# EAGLE design submod (EAGLE 4.13)
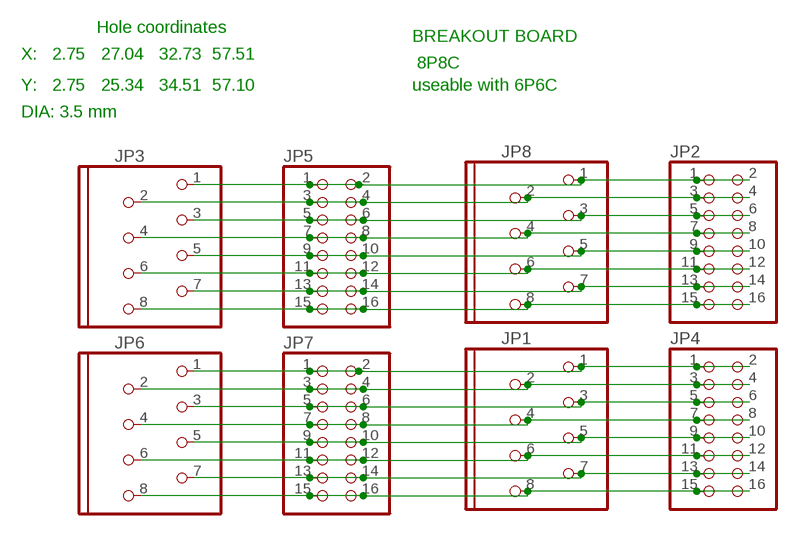
[diagram p0: schematic, sheet 1]

## Parts
JP1  MOD8P8C  [MOD8P8C]
JP2  PINHD-2X8  [2X08]
JP3  MOD8P8C  [MOD8P8C]
JP4  PINHD-2X8  [2X08]
JP5  PINHD-2X8  [2X08]
JP6  MOD8P8C  [MOD8P8C]
JP7  PINHD-2X8  [2X08]
JP8  MOD8P8C  [MOD8P8C]

## Nets
N$1: JP2.1 JP2.2 JP3.1 JP5.1 JP5.2 JP8.1
N$2: JP2.3 JP2.4 JP3.2 JP5.3 JP5.4 JP8.2
N$3: JP2.5 JP2.6 JP3.3 JP5.5 JP5.6 JP8.3
N$4: JP2.7 JP2.8 JP3.4 JP5.7 JP5.8 JP8.4
N$5: JP2.9 JP2.10 JP3.5 JP5.9 JP5.10 JP8.5
N$6: JP2.11 JP2.12 JP3.6 JP5.11 JP5.12 JP8.6
N$7: JP1.1 JP4.1 JP4.2 JP6.1 JP7.1 JP7.2
N$8: JP1.2 JP4.3 JP4.4 JP6.2 JP7.3 JP7.4
N$9: JP1.3 JP4.5 JP4.6 JP6.3 JP7.5 JP7.6
N$10: JP1.4 JP4.7 JP4.8 JP6.4 JP7.7 JP7.8
N$11: JP1.5 JP4.9 JP4.10 JP6.5 JP7.9 JP7.10
N$12: JP1.6 JP4.11 JP4.12 JP6.6 JP7.11 JP7.12
N$13: JP1.7 JP4.13 JP4.14 JP6.7 JP7.13 JP7.14
N$14: JP1.8 JP4.15 JP4.16 JP6.8 JP7.15 JP7.16
N$15: JP2.13 JP2.14 JP3.7 JP5.13 JP5.14 JP8.7
N$16: JP2.15 JP2.16 JP3.8 JP5.15 JP5.16 JP8.8

## Notes on the sheet
- Hole coordinates
- BREAKOUT BOARD
- X: | 2.75 | 27.04 | 32.73 | 57.51
- 8P8C
- Y: | 2.75 | 25.34 | 34.51 | 57.10 | useable with 6P6C
- DIA: 3.5 mm

## Library data of the parts
JP1 JP3 JP6 JP8 = DEH:MOD8P8C
JP2 JP4 JP5 JP7 = pinhead:PINHD-2X8: PIN HEADER

## Board
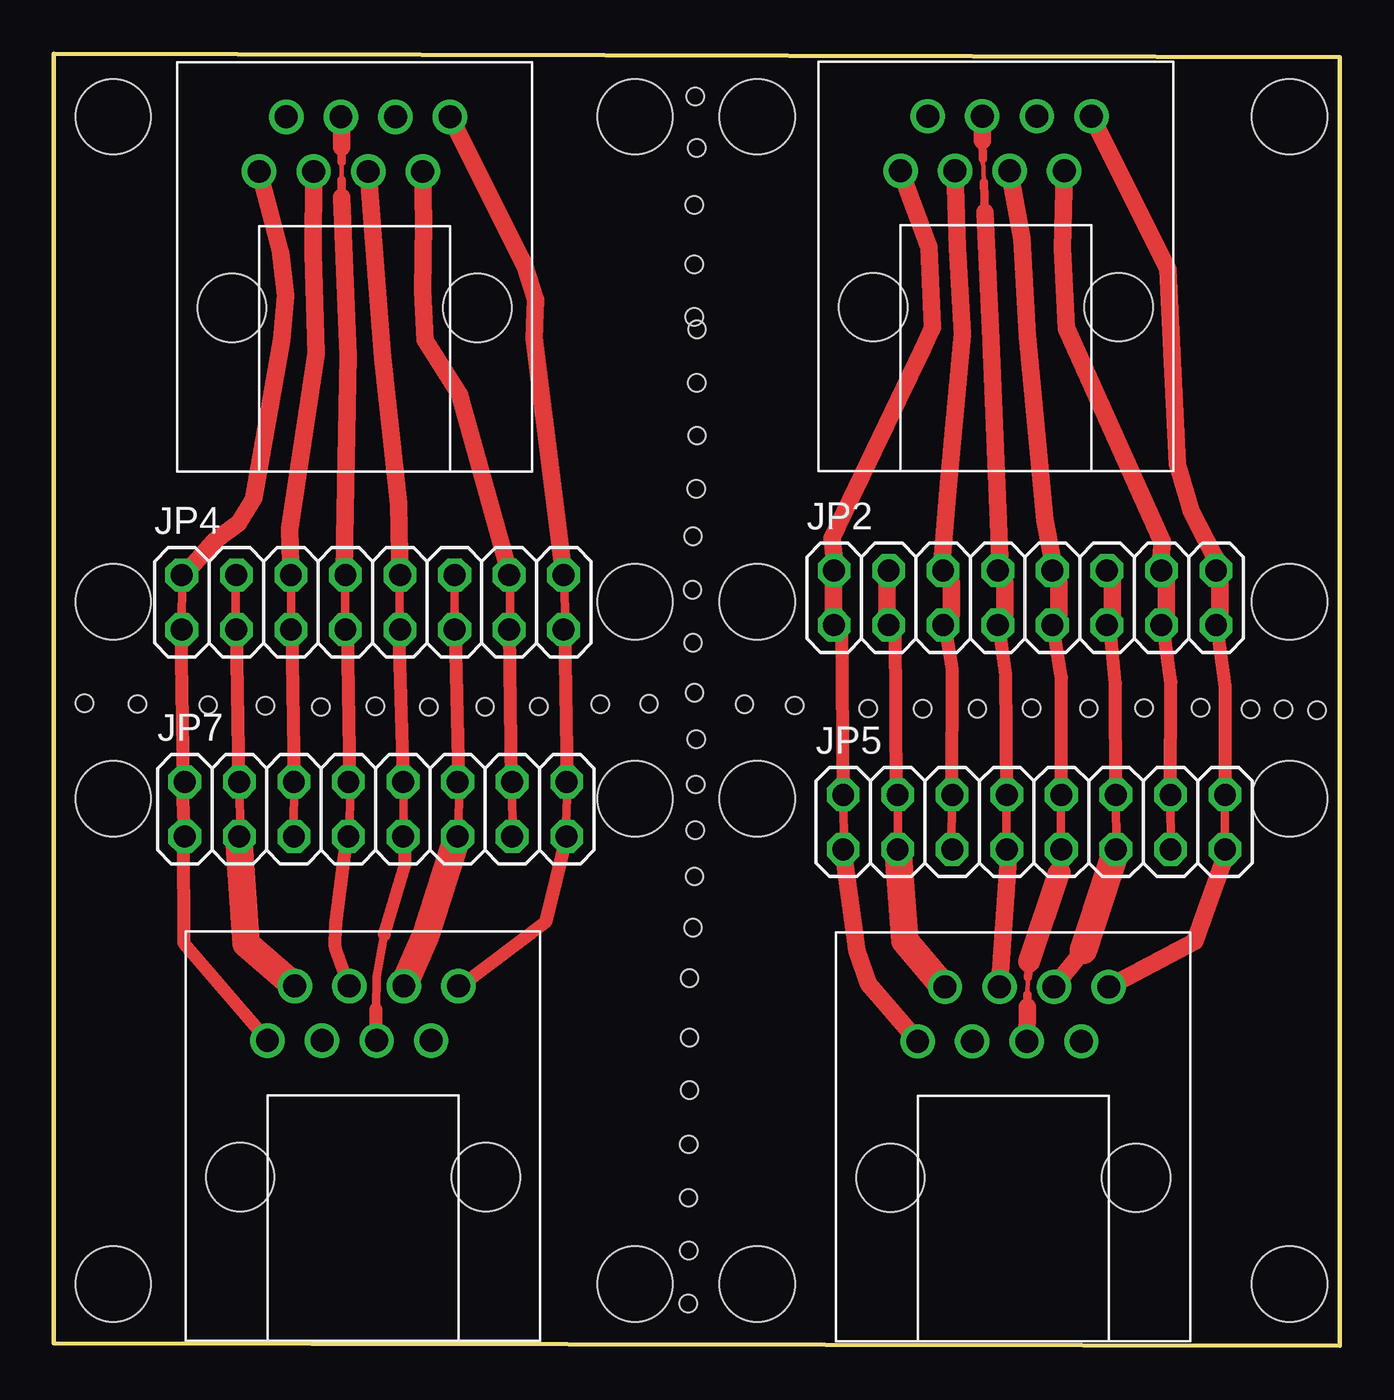
[diagram p1: board, top side]
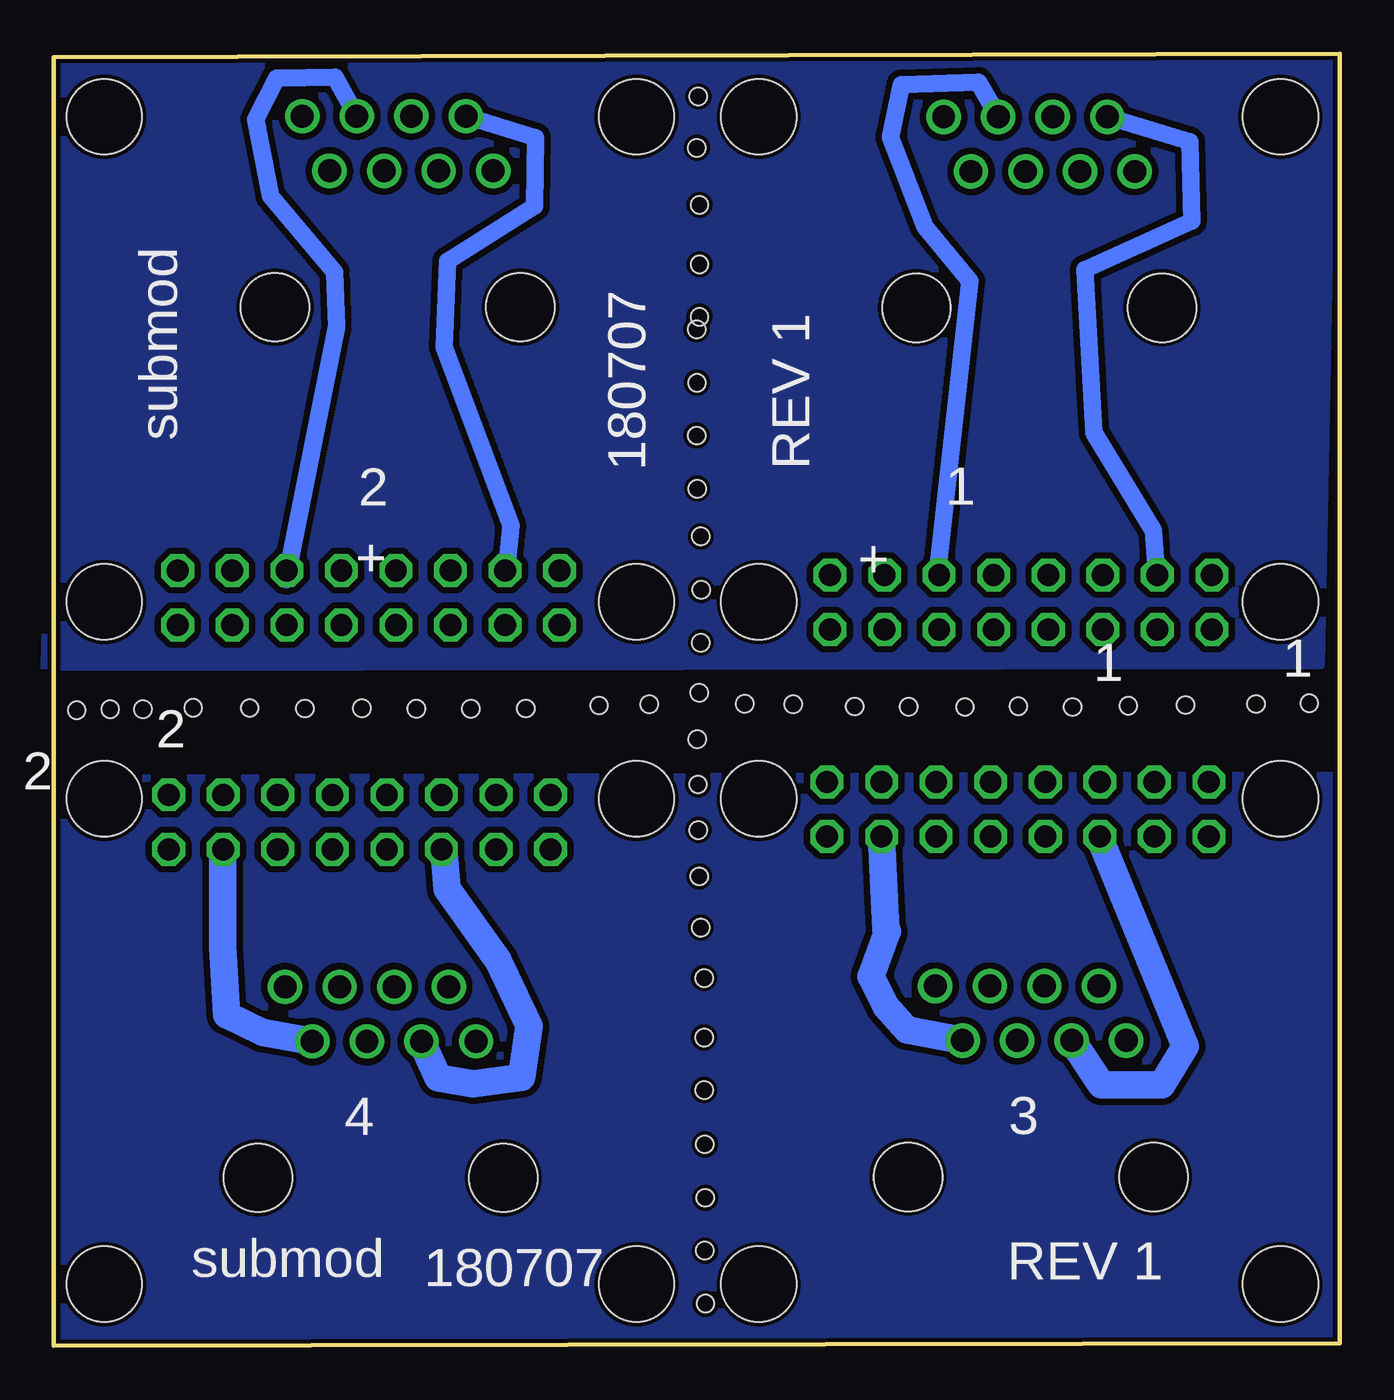
[diagram p2: board, bottom side, seen from below]

Size 59.88 x 60.15 mm. Coordinates in mm from the lower left corner, seen from the top.
Outline: 0,0.11 0,60.15 59.88,59.99 59.87,0 0,0.11
Copper layers (1*16): Top 0.035mm / dielectric 1.5mm / Bottom 0.035mm
Design rules "default": minimum track width 8mil, minimum drill 0.6mm, track to track 12mil, track to pad 10mil, pad to pad 10mil, via to via 8mil, smd to smd 0mil, copper to edge 8mil, drill to drill 8mil, minimum pad ring 8mil, minimum via ring 8mil, stop-mask expansion 4mil, vias tented up to drill 0mil, thermal gap 10mil
Holes 0.8 mm at 3.9,29.88 7.19,29.83 9.85,29.79 12.44,29.74 14.97,29.77 17.46,29.74 20.08,29.75 22.59,29.76 37.91,29.67 40.46,29.65 43,29.65 45.53,29.68 48.19,29.67 50.76,29.69 53.39,29.7 58.81,29.59 55.72,29.63 1.43,29.91 29.95,42.37 29.93,44.83 29.95,47.32 29.82,47.9 29.82,50.34 29.82,53.11 29.94,55.77 29.87,58.16 29.92,39.9 29.57,4.43 29.55,6.89 29.57,9.38 29.6,11.91 29.6,14.35 29.6,17.12 29.76,19.47 29.87,24.01 29.54,1.96 29.76,32.73 29.74,35.19 29.76,37.68 29.83,30.4 25.45,29.87 27.71,29.89 34.49,29.81 32.16,29.86 29.89,26.13 29.92,28.24 57.25,29.63 29.83,21.85
Holes 3.5 mm at 2.77,2.87 2.77,25.46 2.77,34.63 2.77,57.22 27.06,25.46 27.06,57.22 27.06,2.87 32.75,2.87 32.75,25.46 32.75,34.63 32.75,57.22 57.53,25.46 57.53,2.87 57.53,34.63 57.53,57.22 27.06,34.63

### Footprints (pad centres in the part's own frame; a part is rotated, then mirrored left to right if it is on the bottom)
MOD8P8C = drill 1.067 pad 1.397 round: 1 -3.81,-2.54; 2 -2.54,0; 3 -1.27,-2.54; 4 0,0; 5 1.27,-2.54; 6 2.54,0; 7 3.81,-2.54; 8 5.08,0 | hole 3.175: -5.08,-8.89; 6.35,-8.89
2X08 = drill 1.016 octagon: 1 -8.89,-1.27; 2 -8.89,1.27; 3 -6.35,-1.27; 4 -6.35,1.27; 5 -3.81,-1.27; 6 -3.81,1.27; 7 -1.27,-1.27; 8 -1.27,1.27; 9 1.27,-1.27; 10 1.27,1.27; 11 3.81,-1.27; 12 3.81,1.27; 13 6.35,-1.27; 14 6.35,1.27; 15 8.89,-1.27; 16 8.89,1.27

### Placement (x,y rotation side)
JP1  13.37,57.21 0 top
JP2  45.22,34.82 0 top
JP3  44.03,16.71 0 top
JP4  14.85,34.61 0 top
JP5  45.64,24.38 0 top
JP6  13.76,16.75 0 top
JP7  14.99,24.98 0 top
JP8  43.23,57.24 0 top

### Tracks (layer width: path | path; a pad name or v marks a point on that pad's centre or on a via)
GND
  pour Bottom: 0.33,26.54 59.85,26.4 59.85,26.09 59.54,26.09 59.54,0.44 0.48,0.58 0.48,0.51 0.33,0.51
GND2
  pour Bottom: 0.33,59.86 59.66,59.72 59.66,59.59 60.29,31.59 0.89,31.7
N$1
  Top 0.406: JP5.1 36.79,23.11 36.76,25.53
  Top 0.61: 36.76,25.53 JP5.2 | JP5.2 | JP2.1 36.7,33.55 JP5.2 | JP3.1 40.25,14.15
  Top 0.813: JP8.1 40.74,51.14 40.9,47.39 40.44,46.37 36.22,37.61 36.41,36 JP2.2 36.29,35.54 36.29,34.04 JP2.1 | JP5.1 37.39,18.39 37.93,16.84 40.25,14.15
N$2
  Top 0.406: JP5.4 JP5.3
  Top 0.61: JP2.3 38.94,33.55 38.94,33.46 39.18,33.46 39.24,25.65 | 39.24,25.65 39.24,25.5 | JP5.4 39.24,25.65 | JP3.2 41.5,16.61
  Top 0.813: JP2.3 38.79,34.04 38.79,35.54 JP2.4
  Top 1.27: JP5.3 39.63,18.84 41.5,16.61
  Bottom 0.813: JP8.2 37.44,56.23 37.5,53.06 41.54,50.5 41.71,46.5 38.6,38.19 38.8,36.19 JP2.4
N$3
  Top 0.406: JP5.5 41.8,23.1 41.82,25.59
  Top 0.61: JP2.5 41.51,33.55 41.51,33.46 41.83,31.54 JP5.6 | 41.82,25.59 JP5.6 | JP5.6
  Top 0.813: JP8.3 42.07,51.1 42.31,47.09 41.63,39.86 41.31,35.93 JP2.6 41.79,35.54 41.79,34.04 JP2.5
  Bottom 0.61: 41.73,23.17 JP5.5
  Bottom 1.27: JP3.3 41.98,12.47 40.36,12.19 38.1,12.49 37.74,14.9 39.19,17.94 41.57,21.26 41.73,23.17
N$4
  Top 0.203: 43.3,54.17 43.26,55.25
  Top 0.406: 43.26,55.25 43.23,56.11 | 43.35,52.77 43.3,54.17 | JP5.8 44.33,25.6 JP5.7
  Top 0.61: JP2.7 43.99,33.55 44.32,31.24 JP5.8 | 44.48,23.31 JP5.7
  Top 0.813: JP2.7 44.29,34.04 44.29,35.54 JP2.8 44.08,36.08 43.64,46.84 43.35,52.77 | 43.23,56.11 JP8.4 | JP3.4 44.48,23.31
  Bottom 0.813: JP2.7 44.15,33.42
N$5
  Top 0.203: 45.32,16.35 45.35,17.15
  Top 0.406: JP5.9 46.86,23.04 JP5.10 | 45.32,15.78 45.32,16.35 | 45.35,17.15 45.41,17.89
  Top 0.61: JP2.9 46.51,33.6 46.92,31.09 JP5.10 | JP5.9 46.85,23.27 46.82,22.05
  Top 0.813: JP8.5 45.08,51.55 45.32,47 46.14,38.45 46.6,36 JP2.10 46.79,35.54 46.79,34.04 JP2.9 | JP3.5 45.32,15.78
  Top 1.016: 45.41,17.89 46.82,22.05
N$6
  Top 0.406: JP5.11 49.47,23.06 JP5.12
  Top 0.61: JP2.11 49.16,33.55 49.43,30.84 JP5.12 | 49.5,23.17 JP5.11
  Top 0.813: JP2.11 49.29,34.04 49.29,35.54 JP2.12 | JP3.6 47.94,18.41
  Top 1.27: 47.94,18.41 49.5,23.17
  Bottom 0.813: JP8.6 46.78,59.06 49.49,59.02 50.48,57.09 49.79,53.51 46.81,49.98 46.72,47.45 49.05,35.67 JP2.12
N$7
  Top 0.406: JP4.2 5.97,35.85 JP4.1
  Top 0.61: 6.04,26.25 6.04,26.14 | 6.04,26.25 JP7.2 5.98,26.5 JP7.1 6.04,23.79 6.07,18.74 JP6.1 | JP4.1 5.93,33.34 6.04,26.25
  Top 0.813: JP1.1 10.56,50.88 10.8,48.88 10.6,46.82 9.32,39.43 8.6,38.31 7.47,37.47 5.96,35.77 JP4.2
N$8
  Top 0.406: JP4.4 8.44,35.85 JP4.3 | JP7.3 8.71,23.78 8.63,26.2
  Top 0.61: 8.63,26.2 JP7.4 | JP7.4 | JP4.3 8.52,33.34 JP7.4 | 8.61,23.68 JP7.3
  Top 1.27: JP6.2 8.95,18.72 8.61,23.68
  Bottom 0.813: JP1.2 6.98,56.06 6.9,52.36 11.88,50.1 11.46,42.51 8.68,37.95 8.53,35.73 JP4.4
N$9
  Top 0.406: JP4.6 11.08,35.88 JP4.5 | JP7.5 11.13,23.63 11.21,25.98
  Top 0.61: 11.21,25.98 11.21,26.25 | 11.21,26.25 JP7.6 | JP4.5 11.1,33.34 11.21,26.25
  Top 0.813: JP1.3 12.08,50.84 12.22,46.19 10.98,38.03 11.06,35.61 JP4.6
  Bottom 0.61: 11.23,23.74 JP7.5
  Bottom 1.27: JP6.3 11.1,12.15 8.3,12.14 7.2,13.93 11.23,23.74
N$10
  Top 0.203: 13.4,54.29 13.4,55.09
  Top 0.406: 13.4,55.09 13.4,55.79 | 13.4,53.48 13.4,54.29 | JP4.8 13.54,35.85 JP4.7 | JP7.7 13.77,23.77 13.8,26.01
  Top 0.61: 13.8,26.01 13.8,26.25 | 13.8,26.25 JP7.8 | JP4.7 13.69,33.34 13.8,26.25 | JP6.4 13.11,18.55 13.13,19.56 13.67,23.74 JP7.7
  Top 0.813: 13.4,55.79 JP1.4 | 13.4,53.48 13.7,46.09 13.55,37.6 13.51,35.81 JP4.8
N$11
  Top 0.406: 15,15.68 15.03,17.18 15.39,19.13 | JP4.10 16.09,35.84 JP4.9 | JP7.9 16.3,23.75 16.29,26.17
  Top 0.61: 16.29,26.17 16.29,26.25 | 16.29,26.25 JP7.10 | JP4.9 16.09,33.29 16.29,26.25 | JP6.5 15,15.68 | 15.39,19.13 16.35,22.38 16.35,23.71 JP7.9
  Top 0.813: JP1.5 15.32,46.01 16.05,39.2 16.12,35.58 JP4.10
N$12
  Top 0.406: JP4.11 JP4.12 | JP7.11 18.84,23.77 18.86,26.25
  Top 0.61: 18.86,26.25 18.86,26.23 | 18.86,26.25 JP7.12 | JP4.11 18.72,33.32 18.86,26.25 | 18.83,23.82 JP7.11
  Top 1.27: JP6.6 17.34,19.14 18.83,23.82
  Bottom 0.813: JP1.6 16.83,58.83 20.41,58.71 20.92,56.26 19.32,52.09 17.22,49.56 18.73,35.97 JP4.12
N$13
  Top 0.406: JP4.13 21.24,33.27 21.24,35.86 | JP7.13 21.39,23.67 21.32,26.14
  Top 0.61: 21.32,26.14 21.32,26.25 | 21.32,26.25 JP7.14 | JP4.13 21.32,26.25
  Top 0.813: JP1.7 17.22,52.29 17.18,49.09 17.3,46.81 18.9,44.29 21.24,35.86 JP4.14
  Bottom 0.61: 21.06,19.29 21.14,19.36 | 21.35,23.68 JP7.13
  Bottom 1.27: JP6.7 20.16,14.71 21.13,15.8 21.84,17.19 21.06,19.29 | 21.14,19.36 21.35,23.68
N$14
  Top 0.406: JP4.15 23.83,33.39 23.76,35.81 | JP7.15 23.83,23.74 23.92,26.14
  Top 0.61: 23.92,26.14 23.92,26.25 | 23.92,26.25 JP7.16 | JP4.15 23.81,33.34 23.92,26.25 | JP6.8 18.93,16.73 22.92,19.74 23.89,23.74 JP7.15
  Top 0.813: JP1.8 21.93,50.3 22.44,48.7 22.36,46.91 23.76,35.81 JP4.16
N$15
  Top 0.406: JP5.13 52,23.02 JP5.14
  Top 0.61: JP2.13 51.65,33.46 52.01,30.88 JP5.14
  Top 0.813: JP8.7 46.96,51.07 47.14,47.37 51.62,37.41 51.49,36.19 JP2.14 51.79,35.54 51.79,34.04 JP2.13
  Bottom 0.61: 52.01,23.07 JP5.13
  Bottom 1.27: JP3.7 50.15,14.58 51.82,15.4 52.02,18.57 52.01,23.07
N$16
  Top 0.406: JP5.15 54.49,23.1 JP5.16
  Top 0.61: JP2.15 54.14,33.6 54.54,30.72 JP5.16 | 54.66,23.14 JP5.15
  Top 0.813: JP8.8 51.87,50.11 52.07,45.79 52.31,41.05 52.95,38.83 54.33,36.19 JP2.16 54.29,35.54 54.29,34.04 JP2.15 | JP3.8 53.12,18.82 54.66,23.14

### Text on the board
bNames: submod | 180707 | REV 1 | 1 | 2 | + | + | 1 | 1 | 2 | 2 | 3 | 4 | REV 1 | 180707 | submod